# Altium schematic sheet Sheet1.SchDoc
size A4
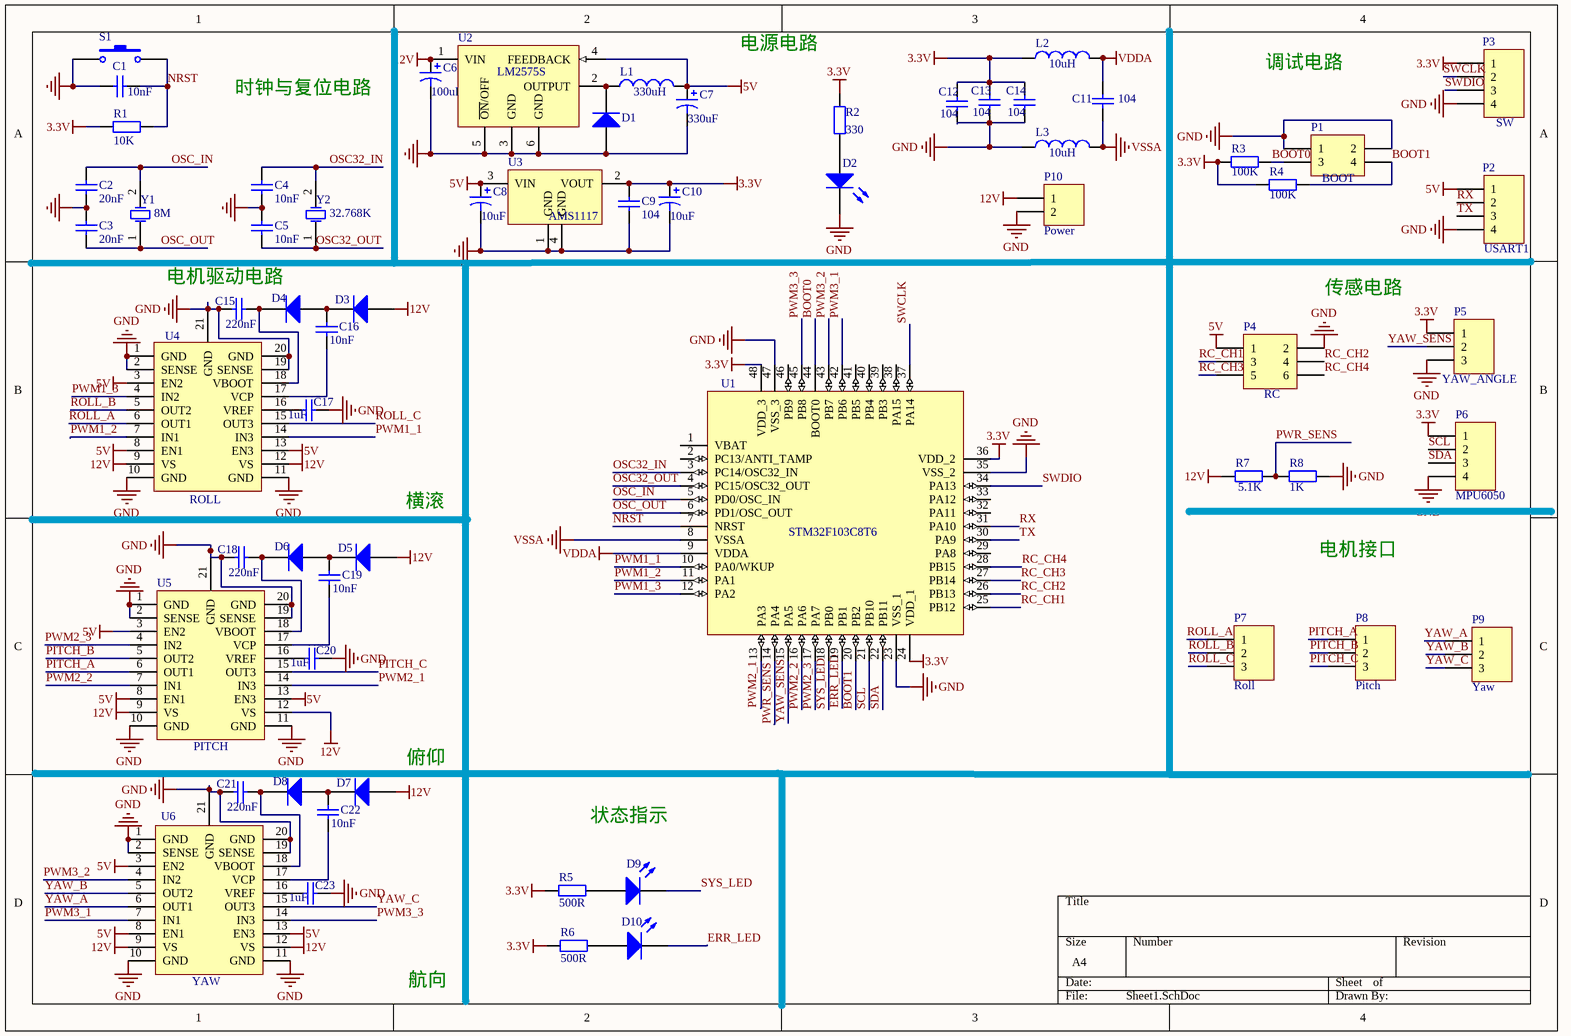
[diagram p0: Sheet1.SchDoc]

## Parts
C1  value 10nF  [0603]  (hidden comment: Cap)
C2  value 20nF  [0603]  (hidden comment: Cap)
C3  value 20nF  [0603]  (hidden comment: Cap)
C4  value 10nF  [0603]  (hidden comment: Cap)
C5  value 10nF  [0603]  (hidden comment: Cap)
C6  value 100uF  [25V 100uF 6*7]  (hidden comment: Cap Pol1)
C7  value 330uF  [25V 330uF 8*10]  (hidden comment: Cap Pol1)
C8  value 10uF  [1206]  (hidden comment: Cap Pol1)
C9  value 104  [0603]  (hidden comment: Cap)
C10  value 10uF  [1206]  (hidden comment: Cap Pol1)
C11  value 104  [0603]  (hidden comment: Cap)
C12  value 104  [0603]  (hidden comment: Cap)
C13  value 104  [0603]  (hidden comment: Cap)
C14  value 104  [0603]  (hidden comment: Cap)
C15  value 220nF  [0603]  (hidden comment: Cap)
C16  value 10nF  [0603]  (hidden comment: Cap)
C17  value 1uF  [0603]  (hidden comment: Cap)
C18  value 220nF  [0603]  (hidden comment: Cap)
C19  value 10nF  [0603]  (hidden comment: Cap)
C20  value 1uF  [0603]  (hidden comment: Cap)
C21  value 220nF  [0603]  (hidden comment: Cap)
C22  value 10nF  [0603]  (hidden comment: Cap)
C23  value 1uF  [0603]  (hidden comment: Cap)
D1  Diode 1N4003  [SMA]  (value not drawn)
D2  D2  [0805]  (value not drawn)
D3  Diode 1N914  [0805]  (value not drawn)
D4  Diode 1N914  [0805]  (value not drawn)
D5  Diode 1N914  [0805]  (value not drawn)
D6  Diode 1N914  [0805]  (value not drawn)
D7  Diode 1N914  [0805]  (value not drawn)
D8  Diode 1N914  [0805]  (value not drawn)
D9  D2  [0805]  (value not drawn)
D10  D2  [0805]  (value not drawn)
L1  value 330uH  [330uH 5.8*5*4]  (hidden comment: Inductor)
L2  value 10uH  [0603]  (hidden comment: Inductor)
L3  value 10uH  [0603]  (hidden comment: Inductor)
P1  BOOT  [2x2P 2mm]
P2  USART1  [4P 2mm]
P3  SW  [4P 2mm]
P4  RC  [6P 2mm]
P5  YAW_ANGLE  [3P 2mm]
P6  MPU6050  [4P 2mm]
P7  Roll  [3P 2mm]
P8  Pitch  [3P 2mm]
P9  Yaw  [3P 2mm]
P10  Power  [2P 2mm]
R1  value 10K  [0603]  (hidden comment: Res2)
R2  value 330  [0603]  (hidden comment: Res2)
R3  value 100K  [0603]  (hidden comment: Res2)
R4  value 100K  [0603]  (hidden comment: Res2)
R5  value 500R  [0603]  (hidden comment: Res2)
R6  value 500R  [0603]  (hidden comment: Res2)
R7  value 5.1K  [0603]  (hidden comment: Res2)
R8  value 1K  [0603]  (hidden comment: Res2)
S1  SW-PB  [SW3*6]  (value not drawn)
U1  STM32F103C8T6  [STM32F103C8T6]
U2  LM2575S  [LM2575S-TO-263-5]
U3  AMS1117  [AMS1117]
U4  L6234D  [L6234DD]  (value not drawn)
U5  L6234D  [L6234DD]  (value not drawn)
U6  L6234D  [L6234DD]  (value not drawn)
Y1  8M  [XTAL 8M]
Y2  32.768K  [XTAL 32.768K]

## Nets
3.3V: C9.2 C10.1 C12.2 C13.2 C14.2 L2.1 P3.1 P5.1 P6.1 R1.1 R2.2 R3.1 R4.1 R5.1 R6.1 U1.24(VDD_1) U1.36(VDD_2) U1.48(VDD_3) U3.2(VOUT)
5V: C7.1 C8.1 L1.2 P2.1 P4.1 U2.4(FEEDBACK) U3.3(VIN) U4.3(EN2) U4.8(EN1) U4.13(EN3) U5.3(EN2) U5.8(EN1) U5.13(EN3) U6.3(EN2) U6.8(EN1) U6.13(EN3)
12V: C6.1 D3.1(A) D5.1(A) D7.1(A) P10.1 R7.1 U2.1(VIN) U4.9(VS) U4.12(VS) U5.9(VS) U5.12(VS) U6.9(VS) U6.12(VS)
GND: C1.1 C2.1 C3.2 C4.1 C5.2 C6.2 C7.2 C8.2 C9.1 C10.2 C12.1 C13.1 C14.1 C15.1 C17.1 C18.1 C20.1 C21.1 C23.1 D1.1(A) D2.2(K) L3.1 P1.1 P1.2 P2.4 P3.4 P4.2 P5.3 P6.4 P10.2 R8.2 S1.1 U1.23(VSS_1) U1.35(VSS_2) U1.47(VSS_3) U2.3(GND) U2.5(~{ON}/OFF) U2.6(GND) U3.1(GND) U3.4(GND) U4.1(GND) U4.2(SENSE) U4.10(GND) U4.11(GND) U4.19(SENSE) U4.20(GND) U4.21(GND) U5.1(GND) U5.2(SENSE) U5.10(GND) U5.11(GND) U5.19(SENSE) U5.20(GND) U5.21(GND) U6.1(GND) U6.2(SENSE) U6.10(GND) U6.11(GND) U6.19(SENSE) U6.20(GND) U6.21(GND)
VDDA: C11.2 L2.2 U1.9(VDDA)
VSSA: C11.1 L3.2 U1.8(VSSA)
BOOT0: P1.3 R3.2 U1.44(BOOT0)
BOOT1: P1.4 R4.2 U1.20(PB2)
ERR_LED: D10.2(K) U1.19(PB1)
NRST: C1.2 R1.2 S1.2 U1.7(NRST)
OSC32_IN: C4.2 U1.3(PC14/OSC32_IN) Y2.2(OSC2)
OSC32_OUT: C5.1 U1.4(PC15/OSC32_OUT) Y2.1(OSC1)
OSC_IN: C2.2 U1.5(PD0/OSC_IN) Y1.2(OSC2)
OSC_OUT: C3.1 U1.6(PD1/OSC_OUT) Y1.1(OSC1)
PITCH_A: P8.1 U5.6(OUT1)
PITCH_B: P8.2 U5.5(OUT2)
PITCH_C: P8.3 U5.15(OUT3)
PWM1_1: U1.10(PA0/WKUP) U4.14(IN3)
PWM1_2: U1.11(PA1) U4.7(IN1)
PWM1_3: U1.12(PA2) U4.4(IN2)
PWM2_1: U1.13(PA3) U5.14(IN3)
PWM2_2: U1.16(PA6) U5.7(IN1)
PWM2_3: U1.17(PA7) U5.4(IN2)
PWM3_1: U1.42(PB6) U6.7(IN1)
PWM3_2: U1.43(PB7) U6.4(IN2)
PWM3_3: U1.45(PB8) U6.14(IN3)
PWR_SENS: R7.2 R8.1 U1.14(PA4)
RC_CH1: P4.3 U1.25(PB12)
RC_CH2: P4.4 U1.26(PB13)
RC_CH3: P4.5 U1.27(PB14)
RC_CH4: P4.6 U1.28(PB15)
ROLL_A: P7.1 U4.6(OUT1)
ROLL_B: P7.2 U4.5(OUT2)
ROLL_C: P7.3 U4.15(OUT3)
RX: P2.2 U1.31(PA10)
SCL: P6.2 U1.21(PB10)
SDA: P6.3 U1.22(PB11)
SWCLK: P3.2 U1.37(PA14)
SWDIO: P3.3 U1.34(PA13)
SYS_LED: D9.2(K) U1.18(PB0)
TX: P2.3 U1.30(PA9)
YAW_A: P9.1 U6.6(OUT1)
YAW_B: P9.2 U6.5(OUT2)
YAW_C: P9.3 U6.15(OUT3)
YAW_SENS: P5.2 U1.15(PA5)
NetC15_2: C15.2 D4.2(K) U4.18(VBOOT)
NetC16_1: C16.1 D3.2(K) D4.1(A)
NetC16_2: C16.2 U4.17(VCP)
NetC17_2: C17.2 U4.16(VREF)
NetC18_2: C18.2 D6.2(K) U5.18(VBOOT)
NetC19_1: C19.1 D5.2(K) D6.1(A)
NetC19_2: C19.2 U5.17(VCP)
NetC20_2: C20.2 U5.16(VREF)
NetC21_2: C21.2 D8.2(K) U6.18(VBOOT)
NetC22_1: C22.1 D7.2(K) D8.1(A)
NetC22_2: C22.2 U6.17(VCP)
NetC23_2: C23.2 U6.16(VREF)
NetD1_2: D1.2(K) L1.1 U2.2(OUTPUT)
NetD2_1: D2.1(A) R2.1
NetD9_1: D9.1(A) R5.2
NetD10_1: D10.1(A) R6.2

Not connected (* = marked no-connect by the designer): U1 1(VBAT) 2(PC13/ANTI_TAMP) 29(PA8) 32(PA11) 33(PA12) 38(PA15) 39(PB3) 40(PB4) 41(PB5) 46(PB9)

## Notes on the sheet
- 时钟与复位电路
- 电源电路
- 调试电路
- (near C15) 电机驱动电路
- 传感电路
- (near U4) ROLL
- 横滚
- 电机接口
- (near U5) PITCH
- (near D7) 俯仰
- 状态指示
- (near U6) YAW
- 航向

## Library data of the parts
C1-C5 C9 C11-C23 = Cap: Capacitor; Published: 8-Jun-2000; LatestRevisionDate: 17-Jul-2002; LatestRevisionNote: Re-released for DXP Platform.; PackageReference: RAD-0.3; Publisher: Altium Limited
C6-C8 C10 = Cap Pol1: Polarized Capacitor (Radial); Published: 8-Jun-2000; LatestRevisionDate: 17-Jul-2002; LatestRevisionNote: Re-released for DXP Platform.; PackageReference: RB7.6-15; Publisher: Altium Limited
D1 = Diode 1N4003: 1 Amp General Purpose Rectifier; Published: 8-Jun-2000; LatestRevisionDate: 17-Jul-2002; LatestRevisionNote: Re-released for DXP Platform.; DatasheetDocument: 1998; PackageDocument: Aug-1999; PackageReference: DO-41; Publisher: Altium Limited; Code_JEDEC: DO-204-AL; ComponentLink1Description: Manufacturer Link; ComponentLink1URL: http://www.fairchildsemi.com/; ComponentLink2Description: Datasheet; ComponentLink2URL: http://www.fairchildsemi.com/ds/1N%2F1N4001.pdf
D2 D9 D10 = LED3: Typical BLUE SiC LED; Published: 8-Jun-2000; LatestRevisionDate: 17-Dec-2003; LatestRevisionNote: PCB Footprint replaced.; DatasheetDocument: 16-Apr-2002; PackageDocument: 16-Apr-2002; PackageReference: 3.5X2.8X1.9; Publisher: Altium Limited
D3-D8 = Diode 1N914: High Conductance Fast Diode; Published: 8-Jun-2000; LatestRevisionDate: 17-Jul-2002; LatestRevisionNote: Re-released for DXP Platform.; DatasheetDocument: 1997; PackageReference: DO-35; Publisher: Altium Limited; Code_JEDEC: DO-204-AH; ComponentLink1Description: Manufacturer Link; ComponentLink1URL: http://www.fairchildsemi.com/; ComponentLink2Description: Datasheet; ComponentLink2URL: http://www.fairchildsemi.com/ds/1N%2F1N4448.pdf
L1-L3 = Inductor: Code_IEC: 1005; Published: 8-Jun-2000; LatestRevisionDate: 17-Jul-2002; LatestRevisionNote: Re-released for DXP Platform.; PackageReference: 0402-A; Publisher: Altium Limited; Code_JEITA: 0402
P1 = Header 2X2: Header, 2-Pin, Dual row; LatestRevisionDate: 17-Jul-2002; LatestRevisionNote: Re-released for DXP Platform.; Publisher: Altium Limited
P2 P3 = Header 4H: Header, 4-Pin, Right Angle; LatestRevisionDate: 17-Jul-2002; LatestRevisionNote: Re-released for DXP Platform.; Publisher: Altium Limited
P4 = Header 3X2: Header, 3-Pin, Dual row; LatestRevisionDate: 17-Jul-2002; LatestRevisionNote: Re-released for DXP Platform.; Publisher: Altium Limited
P5 P7-P9 = Header 3: Header, 3-Pin; LatestRevisionDate: 17-Jul-2002; LatestRevisionNote: Re-released for DXP Platform.; Publisher: Altium Limited
P6 = Header 4: Header, 4-Pin; LatestRevisionDate: 17-Jul-2002; LatestRevisionNote: Re-released for DXP Platform.; Publisher: Altium Limited
P10 = Header 2: Header, 2-Pin; LatestRevisionDate: 17-Jul-2002; LatestRevisionNote: Re-released for DXP Platform.; Publisher: Altium Limited
R1-R8 = Res2: Resistor; Published: 8-Jun-2000; LatestRevisionDate: 17-Jul-2002; LatestRevisionNote: Re-released for DXP Platform.; PackageReference: AXIAL-0.4; Publisher: Altium Limited
S1 = SW-PB: Switch; Published: 24-Mar-1999; LatestRevisionDate: 17-Jul-2002; LatestRevisionNote: Re-released for DXP Platform.; PackageReference: SPST-2; Publisher: Altium Limited
Y1 Y2 = XTAL: Crystal Oscillator; Published: 8-Jun-2000; LatestRevisionDate: 17-Jul-2002; LatestRevisionNote: Re-released for DXP Platform.; PackageReference: R38; Publisher: Altium Limited